# EAGLE design Cansat 2018_V2 (EAGLE 8.4.3)
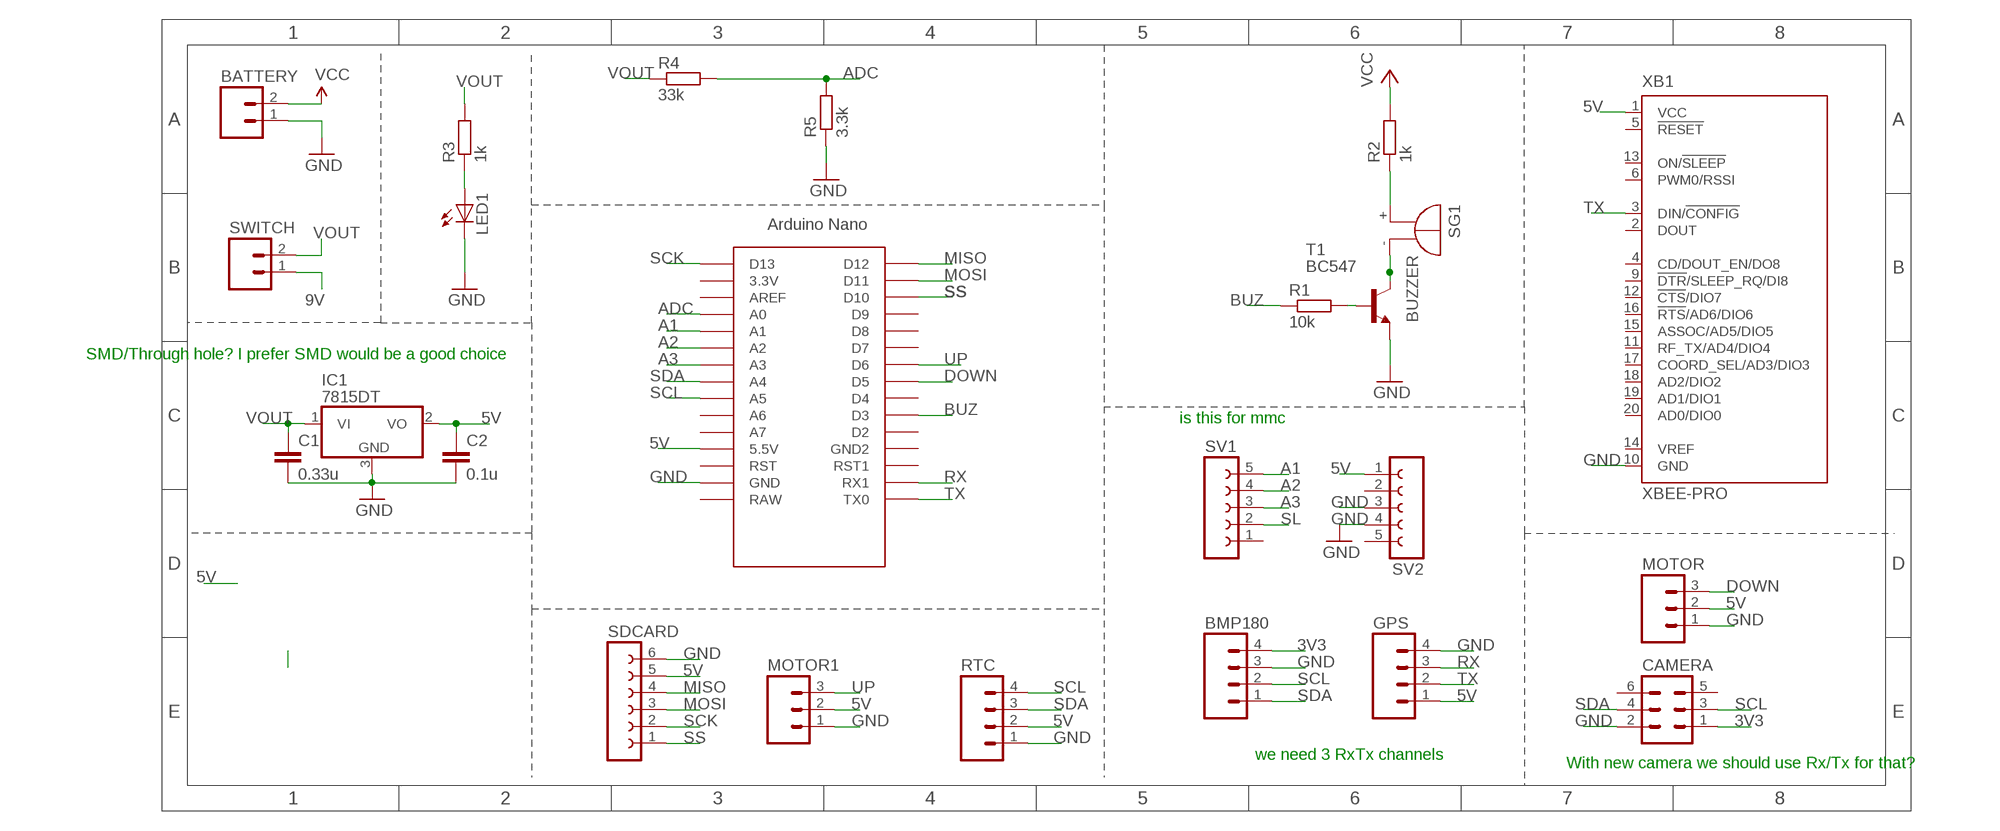
[diagram p0: schematic, sheet 1]

## Parts
BATTERY  M02  [02P]
BMP180  M04  [04P]
C1  0.33u  C-EUC0805  [C0805]
C2  0.1u  C-EUC0805  [C0805]
CAMERA  MA03-2  [MA03-2]
GPS  M04  [04P]
IC1  7815DT  [TO252]
LED1  LED3MM  [LED3MM]
MOTOR  M03  [03P]
MOTOR1  M03  [03P]
R1  10k  R-EU_0207/7  [0207/7]
R2  1k  R-EU_0207/7  [0207/7]
R3  1k  R-EU_0204/7  [0204/7]
R4  33k  R-EU_0207/7  [0207/7]
R5  3.3k  R0207/10  [0207/10]
RTC  M04  [04P]
SDCARD  FE06-1  [FE06]
SG1  BUZZER  [F/TMB]
SV1  FE05-1  [FE05-1]
SV2  FE05-1  [FE05-1]
SWITCH  M02  [02P]
T1  BC547  [TO92]
U$1  NANO  [NANO]
XB1  XBEE-PRO  [XBEE-PRO]

## Nets
3V3: BMP180.4 CAMERA.1 R2.2 ; supply symbol labelled VCC
5V: C2.1 GPS.1 IC1.2(VO) MOTOR1.2 MOTOR.2 RTC.2 SDCARD.5 SV2.1 U$1.5V(5.5V) XB1.1(VCC)
9V: BATTERY.2 SWITCH.1 ; supply symbol labelled VCC
A1: SV1.5 U$1.A1
A2: SV1.4 U$1.A2
A3: SV1.3 U$1.A3
ADC: R5.2 U$1.A0
BUZ: R1.1 U$1.D3
DOWN: MOTOR.3 U$1.D5
GND: BATTERY.1 BMP180.3 C1.2 C2.2 CAMERA.2 GPS.4 IC1.3(GND) LED1.K(C) MOTOR1.1 MOTOR.1 R5.1 RTC.1 SDCARD.6 SV2.3 SV2.4 T1.1(E) U$1.GND XB1.10(GND)
MISO: SDCARD.4 U$1.D12
MOSI: SDCARD.3 U$1.D11
N$1: R1.2 T1.2(B)
N$2: SG1.- T1.3(C)
N$3: R2.1 SG1.+
N$4: LED1.A R3.1
N$5: R4.2
RX: GPS.3 U$1.RX1
SCK: SDCARD.2 U$1.D13
SCL: BMP180.2 CAMERA.3 RTC.4 U$1.A5
SDA: BMP180.1 CAMERA.4 RTC.3 U$1.A4
SL: SV1.2
SS: SDCARD.1 U$1.D10
TX: GPS.2 U$1.TX0 XB1.3(DIN/!CONFIG)
UP: MOTOR1.3 U$1.D6
VOUT: C1.1 IC1.1(VI) R3.2 R4.1 SWITCH.2
Unconnected: CAMERA.5 CAMERA.6 SV1.1 SV2.2 SV2.5 U$1.3.3V U$1.A6 U$1.A7 U$1.AREF U$1.D2 U$1.D4 U$1.D7 U$1.D8 U$1.D9 U$1.GND1(GND2) U$1.ICSP1 U$1.ICSP2 U$1.ICSP3 U$1.ICSP4 U$1.ICSP5 U$1.ICSP6 U$1.RAW U$1.RST U$1.RST1 XB1.2(DOUT) XB1.4(CD/DOUT_EN/DO8) XB1.5(!RESET) XB1.6(PWM0/RSSI) XB1.9(!DTR!/SLEEP_RQ/DI8) XB1.11(RF_TX/AD4/DIO4) XB1.12(!CTS!/DIO7) XB1.13(ON/!SLEEP) XB1.14(VREF) XB1.15(ASSOC/AD5/DIO5) XB1.16(!RTS!/AD6/DIO6) XB1.17(COORD_SEL/AD3/DIO3) XB1.18(AD2/DIO2) XB1.19(AD1/DIO1) XB1.20(AD0/DIO0)

## Notes on the sheet
- SMD/Through hole? I prefer SMD would be a good choice
- is this for mmc
- we need 3 RxTx channels
- With new camera we should use Rx/Tx for that?

## Library data of the parts
BATTERY SWITCH = Arduino_Hackathon_v5:M02: AMP QUICK CONNECTOR
BMP180 GPS RTC = con-amp-quick:M04: AMP QUICK CONNECTOR; OC_FARNELL: unknown; OC_NEWARK: unknown
C1 = rcl:C-EU: CAPACITOR, European symbol
C2 = CPLD_FV34:C-EU: CAPACITOR, European symbol
CAMERA = con-lstb:MA03-2: PIN HEADER; OC_FARNELL: unknown; OC_NEWARK: unknown
IC1 = linear:78*: Positive VOLTAGE REGULATOR Source: http://cache.national.com/ds/LM/LM78L05.pdf http://www.fairchildsemi.com/ds/LM/LM7805.pdf
LED1 = CEDT_JANUARY_2015_v5:LED
MOTOR MOTOR1 = con-amp-quick:M03: AMP QUICK CONNECTOR; OC_FARNELL: unknown; OC_NEWARK: unknown
R1-R4 = rcl:R-EU_: RESISTOR, European symbol
R5 = eagle-ltspice:R: RESISTOR, European symbol; SPICEMODEL: NONE; SPICEPREFIX: R
SDCARD = con-lsta:FE06-1: FEMALE HEADER; OC_FARNELL: unknown; OC_NEWARK: unknown
SG1 = Arduino_Hackathon_v5:BUZZER: BUZZER Source: Buerklin; OC_FARNELL: unknown; OC_NEWARK: unknown
SV1 SV2 = con-lsta:FE05-1: FEMALE HEADER; OC_FARNELL: unknown; OC_NEWARK: unknown
T1 = Arduino_Hackathon_v5:BC547: NPN TRANSISTOR Datasheet <https://www.fairchildsemi.com/datasheets/BC/BC547.pdf>
U$1 = Arduino-clone:NANO: Arduino Nano
XB1 = maxstream:XBEE: XBee (TM) /XBee-PRO(TM) OEM RF Modules Source: MaxStream, Inc. xbee_productmanual.pdf; MPN: XBP24-AWI-001; OC_FARNELL: 1337916; OC_NEWARK: 42M2667

## Board
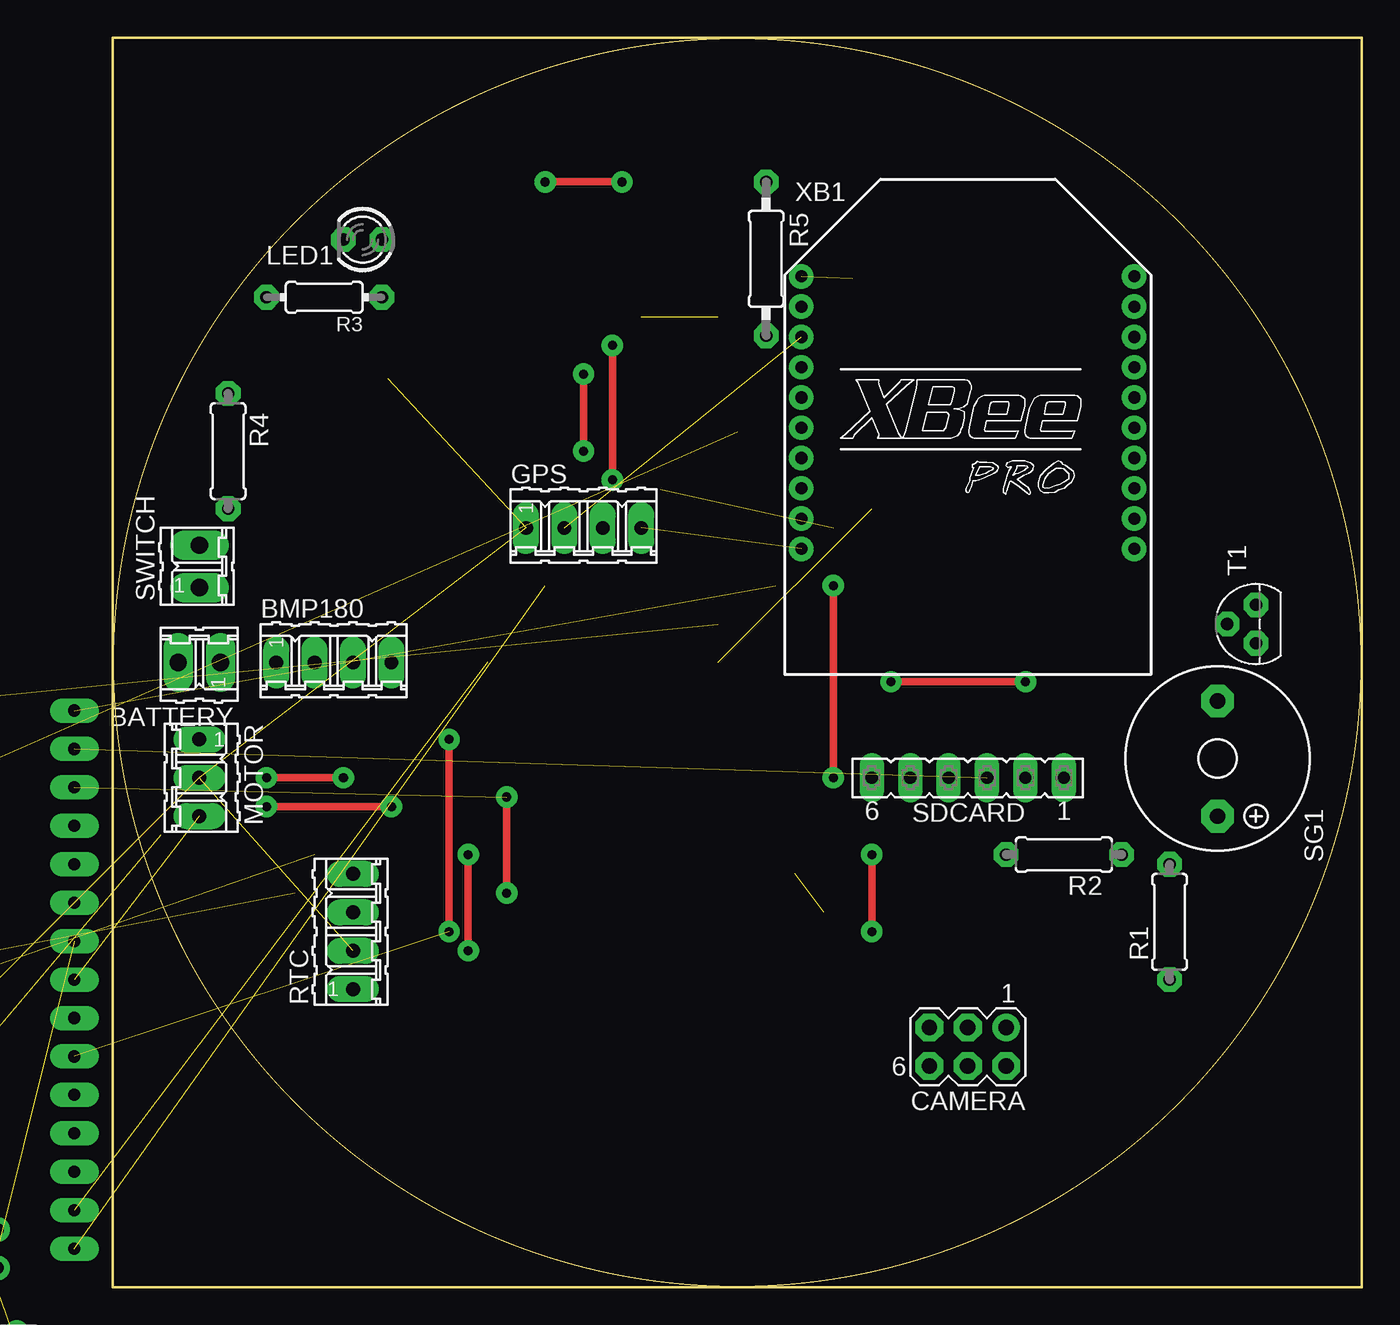
[diagram p1: board, top side]
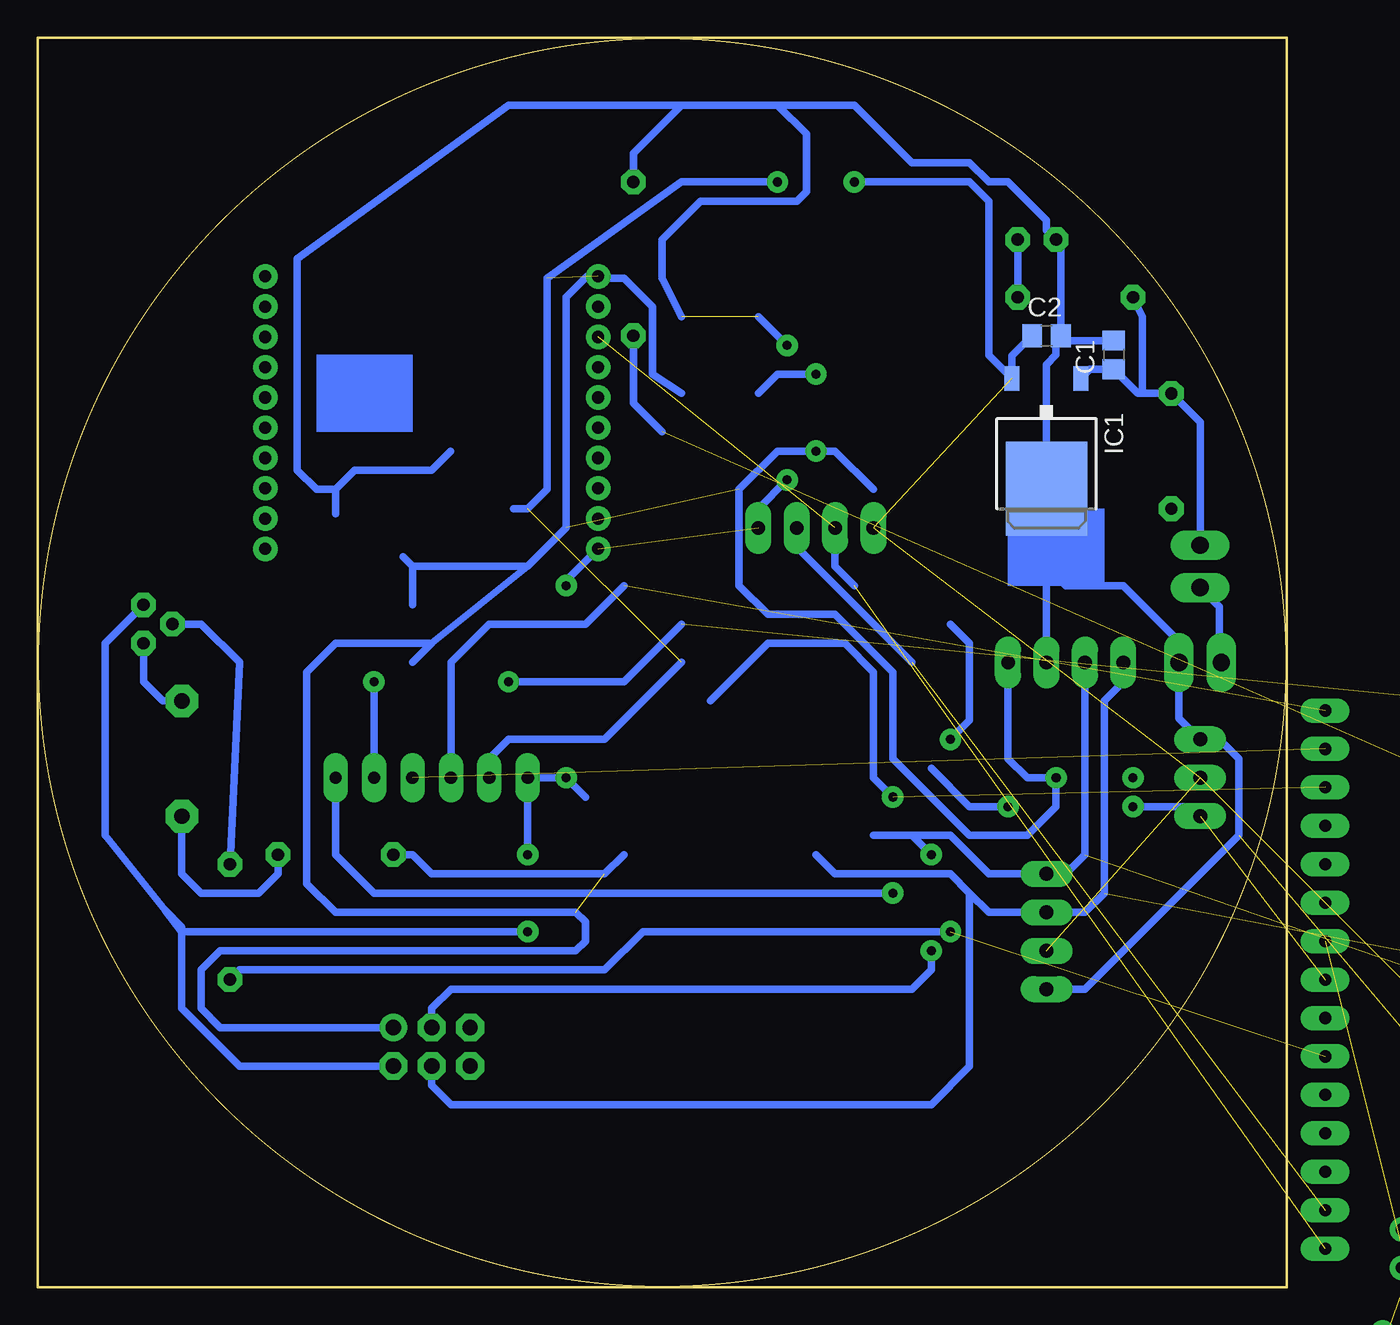
[diagram p2: board, bottom side, seen from below]

Size 82.55 x 82.55 mm. Coordinates in mm from the lower left corner, seen from the top.
Outline: 82.55,2.54 82.55,82.55 0,82.55 0,0 82.55,0 82.55,2.54
Outline: circle at 41.27,41.27 radius 41.21
Copper layers (1*16): Top 0.035mm / dielectric 1.5mm / Bottom 0.035mm
Design rules "default *": minimum track width 10mil, minimum drill 24mil, track to track 8mil, track to pad 8mil, pad to pad 8mil, via to via 8mil, smd to smd 8mil, copper to edge 40mil, drill to drill 8mil, minimum pad ring 16mil, minimum via ring 16mil, stop-mask expansion 4mil, vias tented up to drill 0mil, thermal gap 10mil

### Footprints (pad centres in the part's own frame; a part is rotated, then mirrored left to right if it is on the bottom)
02P = drill 1.143 long: 1 -1.397,0; 2 1.397,0
04P = drill 0.914 long: 1 -3.81,0; 2 -1.27,0; 3 1.27,0; 4 3.81,0
C0805 = smd 1.3 x 1.5: 1 -0.95,0; 2 0.95,0
MA03-2 = drill 1.016: 1 -2.54,-1.27 | drill 1.016 octagon: 2 -2.54,1.27; 3 0,-1.27; 4 0,1.27; 5 2.54,-1.27; 6 2.54,1.27
TO252 = smd 1 x 1.6: 1 -2.28,-4.8; 2 2.28,-4.8 | smd 5.4 x 6.2: 3 0,2.5
LED3MM = drill 0.813 octagon: A -1.27,0; K 1.27,0
03P = drill 0.914 long: 1 -2.54,0; 2 0,0; 3 2.54,0
0207/7 = drill 0.813 octagon: 1 -3.81,0; 2 3.81,0
0204/7 = drill 0.813 octagon: 1 -3.81,0; 2 3.81,0
0207/10 = drill 0.813 octagon: 1 -5.08,0; 2 5.08,0
FE06 = drill 0.813 long: 1 -6.35,0; 2 -3.81,0; 3 -1.27,0; 4 1.27,0; 5 3.81,0; 6 6.35,0
F/TMB = drill 1.016 pad 2.159 octagon: + 3.81,0; - -3.81,0
FE05-1 = drill 0.813 long: 1 -5.08,0; 2 -2.54,0; 3 0,0; 4 2.54,0; 5 5.08,0
TO92 = drill 0.813 octagon: 1 1.27,0; 2 0,1.905; 3 -1.27,0
NANO = drill 0.8 long: 3.3V -10.16,24.13; 5V -10.16,-1.27; A0 -10.16,19.05; A1 -10.16,16.51; A2 -10.16,13.97; A3 -10.16,11.43; A4 -10.16,8.89; A5 -10.16,6.35; A6 -10.16,3.81; A7 -10.16,1.27; AREF -10.16,21.59; D2 5.08,1.27; D3 5.08,3.81; D4 5.08,6.35; D5 5.08,8.89; D6 5.08,11.43; D7 5.08,13.97; D8 5.08,16.51; D9 5.08,19.05; D10 5.08,21.59; D11 5.08,24.13; D12 5.08,26.67; D13 -10.16,26.67; GND -10.16,-6.35; GND1 5.08,-1.27; RAW -10.16,-8.89; RST -10.16,-3.81; RST1 5.08,-3.81; RX1 5.08,-6.35; TX0 5.08,-8.89 | drill 0.8: ICSP1 -5.08,-10.16; ICSP2 -5.08,-7.62; ICSP3 -2.54,-10.16; ICSP4 -2.54,-7.62; ICSP5 0,-10.16; ICSP6 0,-7.62
XBEE-PRO = drill 0.8 pad 1.27: 1 -11,9; 2 -11,7; 3 -11,5; 4 -11,3; 5 -11,1; 6 -11,-1; 7 -11,-3; 8 -11,-5; 9 -11,-7; 10 -11,-9; 11 11,-9; 12 11,-7; 13 11,-5; 14 11,-3; 15 11,-1; 16 11,1; 17 11,3; 18 11,5; 19 11,7; 20 11,9

### Placement (x,y rotation side)
BATTERY  5.72,41.27 180 top
BMP180  14.61,41.27 0 top
C1  11.43,61.59 90 bottom
C2  15.88,62.87 0 bottom
CAMERA  56.52,15.88 180 top
GPS  31.12,50.16 0 top
IC1  15.88,55.24 180 bottom
LED1  16.51,69.22 180 top
MOTOR  5.72,33.66 270 top
MOTOR1  -15.24,-17.78 0 top  (outside the outline)
R1  69.85,24.13 90 top
R2  62.87,28.57 180 top
R3  13.97,65.41 180 top
R4  7.62,55.24 270 top
R5  43.18,67.94 270 top
RTC  15.88,23.5 90 top
SDCARD  56.52,33.66 180 top
SG1  73.03,34.92 270 top
SV1  -11.43,-3.81 0 top  (outside the outline)
SV2  -11.43,-10.16 0 top  (outside the outline)
SWITCH  5.72,47.62 90 top
T1  75.56,43.81 90 top
U$1  -7.62,11.43 0 top
XB1  56.52,57.78 0 top

### Tracks (layer width: path | path; a pad name or v marks a point on that pad's centre or on a via)
3V3  (via drill 0.6)  (2 unrouted)
  Top 0.508: v10.16,33.66 v15.24,33.66 | v31.12,60.33 v31.12,55.24
  Bottom 0.508: 58.42,48.26 57.78,47.62 | 57.78,47.62 57.78,45.1 | 46.25,66.78 47.62,65.41 47.62,50.16 50.16,47.62 | 50.16,47.62 57.78,47.62 | 43.81,28.57 45.09,27.3 56.52,27.3 57.78,28.57 R2.2 | 56.52,42.55 50.16,47.62 | BMP180.4 18.41,34.92 17.14,33.66 v15.24,33.66 15.24,31.75 17.14,29.84 20.96,29.84 26.04,34.92 26.04,40.64 29.84,44.45 34.29,44.45 36.2,46.35 36.2,52.7 33.66,55.24 v31.12,55.24 29.84,55.24 27.3,52.7 | 56.52,42.55 62.87,42.55 64.77,40.64 64.77,26.67 62.87,24.77 46.99,24.77 46.36,24.13 46.36,22.86 46.99,22.23 70.48,22.23 71.75,20.95 71.75,18.41 70.48,17.14 CAMERA.1 | 57.78,41.27 56.52,42.55 | v31.12,60.33 33.66,60.33 34.92,59.05
5V  (via drill 0.6)  (8 unrouted)
  Top 0.508: v28.58,73.03 v33.66,73.03
  Bottom 0.508: C2.1 18.16,61.53 IC1.2 19.69,61.58 19.69,71.75 20.96,73.03 v28.58,73.03 | 51.12,51.44 50.16,51.44 48.9,52.7 48.9,66.67 40.01,73.03 v33.66,73.03 | SDCARD.5 52.7,34.92 51.44,36.2 45.09,36.2 40.01,41.27 | 40.01,59.05 41.91,60.33 41.91,64.77 43.81,66.67 45.41,66.67 XB1.1
9V
  Bottom 0.508: SWITCH.1 4.45,44.96 4.45,42.55 4.32,42.42 BATTERY.2
A1  (1 unrouted)
A2  (1 unrouted)
A3  (1 unrouted)
ADC  (1 unrouted)
  Bottom 0.508: R5.2 43.18,58.42 41.27,56.52
BUZ  (via drill 0.6)  (1 unrouted)
  Top 0.508: v22.23,36.2 v22.23,23.5
  Bottom 0.508: 22.23,43.81 20.96,42.55 20.96,37.47 v22.23,36.2 | R1.1 69.22,20.95 45.09,20.95 42.55,23.5 v22.23,23.5
DOWN  (via drill 0.6)  (1 unrouted)
  Top 0.508: v18.41,31.75 v10.16,31.75
  Bottom 0.508: 23.5,34.29 20.96,31.75 v18.41,31.75 | v10.16,31.75 6.35,31.75 MOTOR.3
GND  (via drill 0.6)  (6 unrouted)
  Top 0.508: v47.62,33.66 v47.62,46.35 | v50.16,23.5 v50.16,28.57 | v33.02,53.34 v33.02,62.23
  Bottom 0.508: 55.26,55.23 56.52,53.98 61.59,53.98 62.87,52.7 | 62.87,52.7 62.87,51.1 | 33.66,78.11 28.58,78.11 24.77,74.3 20.96,74.3 19.69,73.03 18.41,73.03 15.88,70.48 15.88,69.85 LED1.K 14.93,68.9 C2.2 | 40.01,78.11 51.44,78.11 65.41,67.94 65.41,53.98 64.14,52.7 62.87,52.7 | 40.01,78.11 33.66,78.11 | C2.2 15.24,62.55 15.24,61.59 15.88,60.96 IC1.3 15.88,47.62 | C1.2 14.61,62.55 C2.2 | BATTERY.1 7.11,37.59 MOTOR.1 4.45,36.2 3.17,34.92 3.17,29.84 13.34,19.68 RTC.1 | BATTERY.1 7.11,41.4 | v47.62,46.35 47.62,46.67 XB1.10 | v50.16,23.5 73.03,23.5 74.14,24.89 | v50.16,28.57 SDCARD.6 v47.62,33.66 46.36,32.38 | 74.14,24.89 78.11,29.84 78.11,42.55 T1.1 | 33.66,78.11 31.75,76.2 31.75,72.39 32.38,71.75 38.73,71.75 41.27,69.22 41.27,66.67 40.01,64.14 | BMP180.3 15.88,47.62 | BATTERY.1 7.11,42.67 10.8,46.35 14.61,46.35 15.88,47.62 | CAMERA.2 69.22,14.61 73.03,18.41 73.03,23.77 74.14,24.89 | v33.02,62.23 34.92,64.14 | R5.1 43.18,74.93 40.01,78.11 | v33.02,53.34 34.92,51.44 GPS.4
MISO  (1 unrouted)
  Bottom 0.508: SDCARD.4 55.25,41.27 52.7,43.81 46.36,43.81 43.81,46.35
MOSI  (1 unrouted)
N$1
  Bottom 0.508: R1.2 69.22,41.27 71.75,43.81 T1.2
N$2
  Bottom 0.508: T1.3 75.56,40.01 74.3,38.73 SG1.-
N$3
  Bottom 0.508: SG1.+ 73.03,27.3 71.75,26.04 67.94,26.04 66.67,27.3 R2.1
N$4
  Bottom 0.508: R3.1 LED1.A
RX  (1 unrouted)
  Bottom 0.508: GPS.3 32.38,48.9 24.77,41.27
SCK  (via drill 0.6)  (1 unrouted)
  Top 0.508: v51.44,40.01 v60.33,40.01
  Bottom 0.508: 60.33,34.92 SDCARD.2 v60.33,40.01 | 40.01,43.81 43.81,40.01 v51.44,40.01
SCL  (via drill 0.6)  (1 unrouted)
  Top 0.508: v23.5,22.23 v23.5,28.57
  Bottom 0.508: BMP180.2 13.34,28.57 14.61,27.3 RTC.4 19.69,27.3 22.23,29.84 24.77,29.84 | CAMERA.3 56.52,18.41 55.25,19.68 24.77,19.68 23.5,20.95 v23.5,22.23 | 24.77,29.84 27.3,29.84 | v23.5,28.57 24.77,29.84
SDA  (1 unrouted)
  Bottom 0.508: 31.12,28.57 29.84,27.3 22.23,27.3 20.96,26.04 | BMP180.1 10.8,40.01 12.07,38.73 12.07,26.04 13.34,24.77 RTC.3 19.69,24.77 20.96,26.04 | CAMERA.4 56.52,13.34 55.25,12.06 23.5,12.06 20.96,14.61 20.96,26.04
SS  (via drill 0.6)  (1 unrouted)
  Top 0.508: v26.04,26.04 v26.04,32.38
  Bottom 0.508: SDCARD.1 62.87,28.57 60.33,26.04 v26.04,26.04 | 38.1,38.73 34.29,42.55 29.21,42.55 27.3,40.64 27.3,33.66 v26.04,32.38
TX  (2 unrouted)
  Bottom 0.508: GPS.2 29.84,47.62 28.58,46.35
UP  (1 unrouted)
VOUT
  Bottom 0.508: SWITCH.2 5.72,57.15 R4.1 9.53,59.05 | IC1.1 13,60.65 C1.1 9.84,59.05 9.53,59.05 | R3.2 9.53,64.14 9.53,59.05
(copper drawn outside any net)
  shapes: Bottom area x2